# EAGLE design receiver (EAGLE 7.4.0)
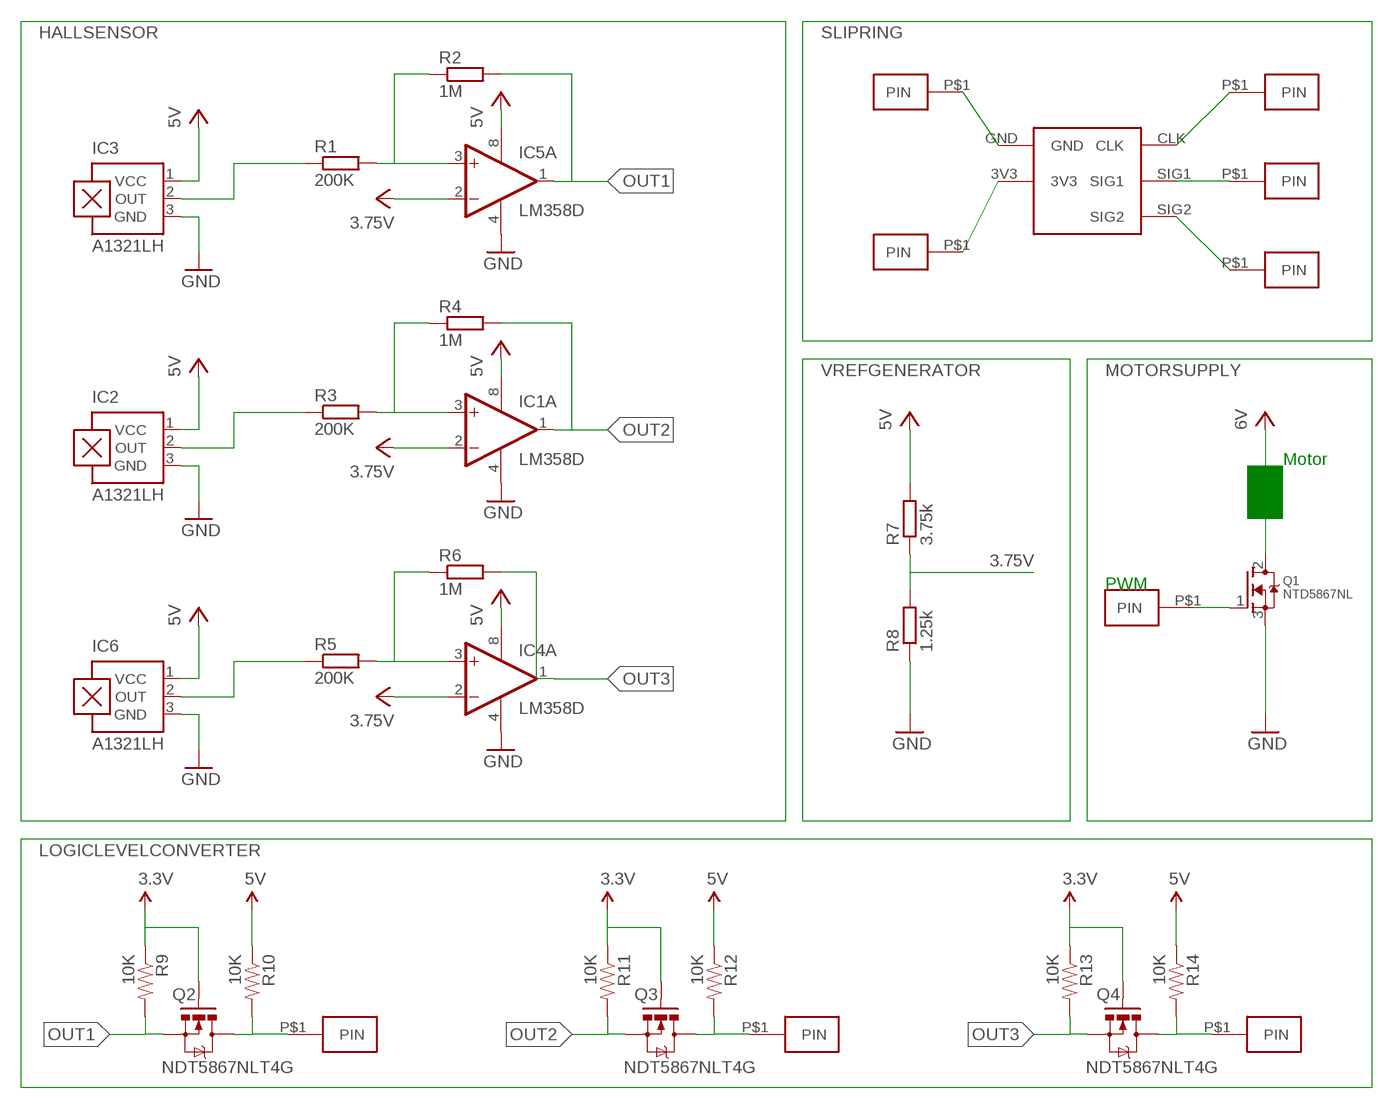
[diagram p0: schematic, sheet 1]

## Parts
IC1  LM358D  [SO08]
IC2  A1321LH  [SOT23-W]
IC3  A1321LH  [SOT23-W]
IC4  LM358D  [SO08]
IC5  LM358D  [SO08]
IC6  A1321LH  [SOT23-W]
PWM  PWM  CONNECTOR  [CONNECTOR]
Q1  NTD5867NL  MOSFET-NGDS_TO220V  [TO220V]
Q2  NDT5867NLT4G  MOSFET-NCHANNELSMD  [SOT23-3]
Q3  NDT5867NLT4G  MOSFET-NCHANNELSMD  [SOT23-3]
Q4  NDT5867NLT4G  MOSFET-NCHANNELSMD  [SOT23-3]
R1  200K  R-EU_R0805  [R0805]
R2  1M  R-EU_R0805  [R0805]
R3  200K  R-EU_R0805  [R0805]
R4  1M  R-EU_R0805  [R0805]
R5  200K  R-EU_R0805  [R0805]
R6  1M  R-EU_R0805  [R0805]
R7  3.75k  R-EU_R0805  [R0805]
R8  1.25k  R-EU_R0805  [R0805]
R9  10K  RESISTOR0603-RES  [0603-RES]
R10  10K  RESISTOR0603-RES  [0603-RES]
R11  10K  RESISTOR0603-RES  [0603-RES]
R12  10K  RESISTOR0603-RES  [0603-RES]
R13  10K  RESISTOR0603-RES  [0603-RES]
R14  10K  RESISTOR0603-RES  [0603-RES]
U$1  SLIP-RING  [SLIP-RING]
U$2  CONNECTOR  [CONNECTOR]
U$3  CONNECTOR  [CONNECTOR]
U$4  CONNECTOR  [CONNECTOR]
U$5  CONNECTOR  [CONNECTOR]
U$6  CONNECTOR  [CONNECTOR]
U$7  CONNECTOR  [CONNECTOR]
U$8  CONNECTOR  [CONNECTOR]
U$9  CONNECTOR  [CONNECTOR]

## Nets
1: IC5.1(A:OUT) R2.2
2: IC1.1(A:OUT) R4.2
3: IC4.1(A:OUT) R6.2
3.75V: IC5.2(A:-IN) R7.1 R8.2
5V: IC1.8(P:V+) IC2.1(VCC) IC3.1(VCC) IC4.8(P:V+) IC5.8(P:V+) IC6.1(VCC) R7.2
GND: IC1.4(P:V-) IC2.3(GND) IC3.3(GND) IC4.4(P:V-) IC5.4(P:V-) IC6.3(GND) Q1.3(S) R8.1
HV: R10.1 R12.1 R14.1 ; supply symbol labelled 5V
HV1: Q2.3(D) R10.2 U$4.P$1(PIN)
HV2: Q3.3(D) R12.2 U$2.P$1(PIN)
HV3: Q4.3(D) R14.2 U$3.P$1(PIN)
N$1: IC2.2(OUT) R3.1
N$2: PWM.P$1(PIN)
N$4: IC3.2(OUT) R1.1
N$5: IC5.3(A:+IN) R1.2 R2.1
N$7: IC6.2(OUT) R5.1
N$8: IC4.3(A:+IN) R5.2 R6.1
N$10: U$1.CLK U$5.P$1(PIN)
N$11: U$1.SIG1 U$6.P$1(PIN)
N$12: U$1.SIG2 U$7.P$1(PIN)
N$13: U$1.GND U$8.P$1(PIN)
N$14: U$1.3V3 U$9.P$1(PIN)
OUT1: Q2.2(S) R9.2
OUT2: Q3.2(S) R11.2
OUT3: Q4.2(S) R13.2
R20: IC1.3(A:+IN) R3.2 R4.1
VCC: IC1.2(A:-IN) IC4.2(A:-IN) Q1.2(D) Q2.1(G) Q3.1(G) Q4.1(G) R9.1 R11.1 R13.1 ; supply symbol labelled 3.75V, 6V, 3.3V
Unconnected: IC1.5(B:+IN) IC1.6(B:-IN) IC1.7(B:OUT) IC4.5(B:+IN) IC4.6(B:-IN) IC4.7(B:OUT) IC5.5(B:+IN) IC5.6(B:-IN) IC5.7(B:OUT) Q1.1(G)

## Notes on the sheet
- Motor
- PWM

## Library data of the parts
IC1 IC4 IC5 = linear:LM358: OP AMP also LM158; LM258; LM2904 Source: http://cache.national.com/ds/LM/LM158.pdf
IC2 IC3 IC6 = allegro:A13*?: Linear Hall Effect Sensor ICs Continuous-Time Ratiometric High-Temperature Operation Programmable Linear with Analog Output A1302 -Replacement- UGN3503 Source: http://www.allegromicro.com/en/Products/Part_Numbers/1301/1301.pdf http://www.allegromicro.com/en/Products/Part_Numbers/1321/1321.pdf http://www.allegromicro.com/en/Products/Part_Numbers/1381/1381.pdf; MF: ALLEGRO MICROSYSTEMS, INC.; MPN: A1321LLHLT-T; OC_FARNELL: 1457116; OC_NEWARK: 65K5146
PWM U$2-U$9 = slip_ring:CONNECTOR
Q1 = adafruit:MOSFET-N: N-Channel Mosfet 2N7002E - 60V 260mA SOT23 [Digikey: 2N7002ET1GOSTR-ND] - REEL BSH103 - 30V 850mA SOT23 [Digikey: 568-5013-1-ND]
Q2-Q4 = SparkFun:MOSFET-NCHANNEL
R1-R8 = resistor:R-EU_: RESISTOR, European symbol
R9-R14 = SparkFun:RESISTOR: Resistor Basic schematic elements and footprints for 0603, 1206, and PTH resistors.
U$1 = slip_ring:SLIP-RING: Slip ring. Stationary part of a slip ring.

## Board
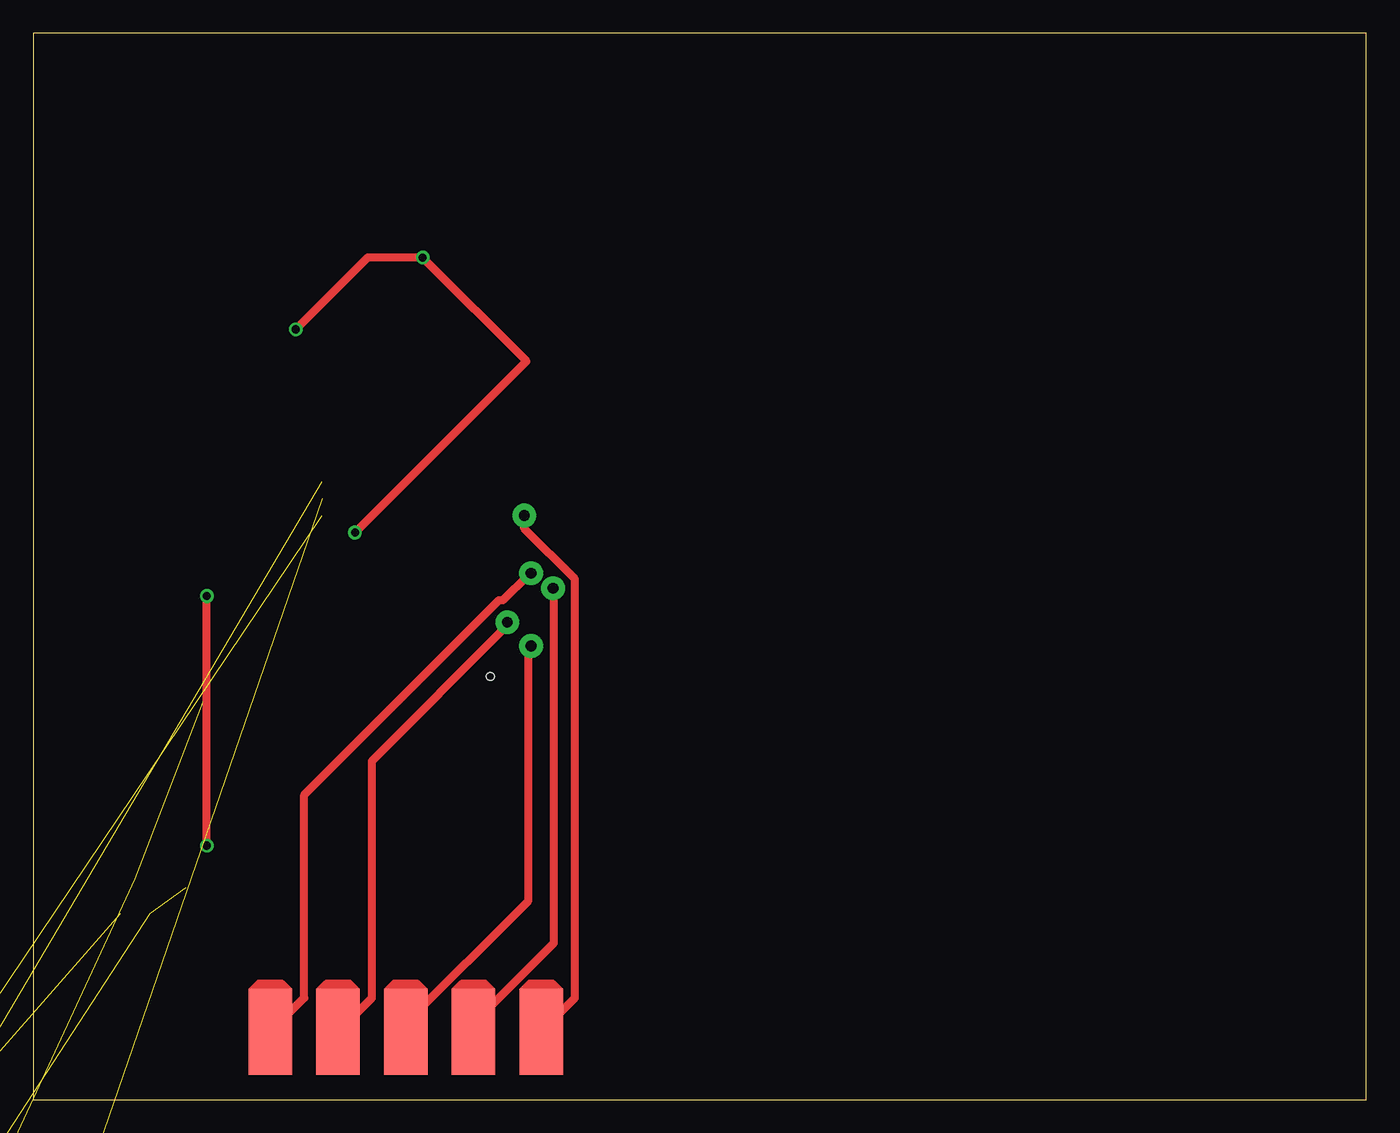
[diagram p1: board, top side]
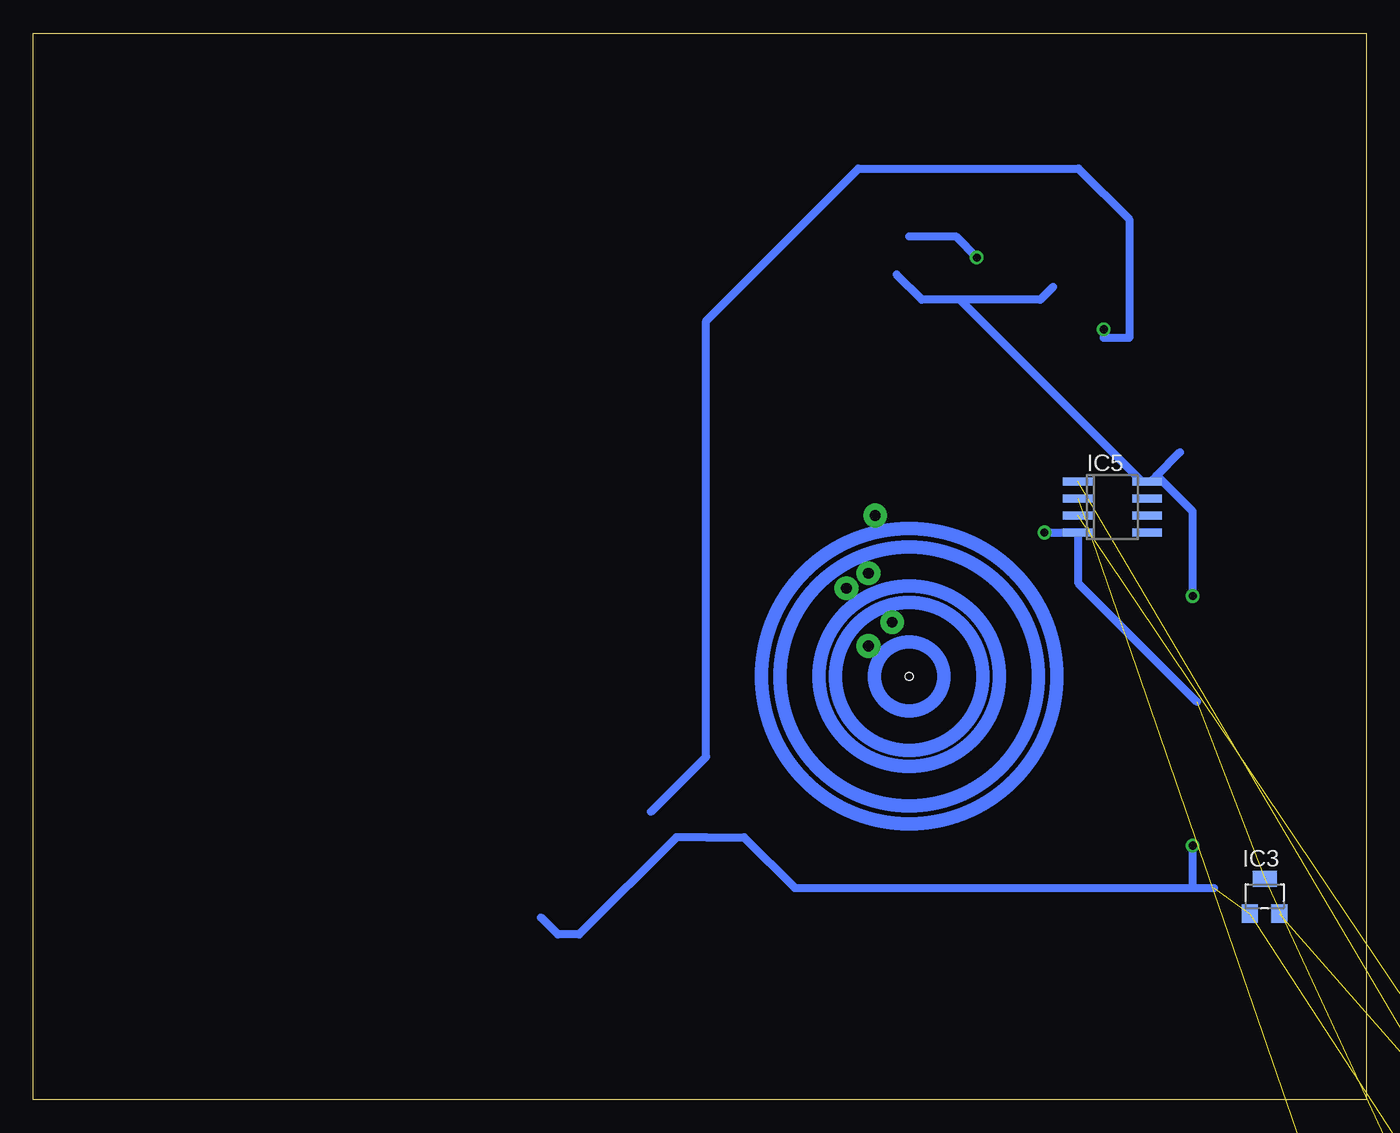
[diagram p2: board, bottom side, seen from below]

Size 100 x 80 mm. Coordinates in mm from the lower left corner, seen from the top.
Outline: 0,0 100,0 100,80 0,80 0,0
Copper layers (1*16): Top 0.035mm / dielectric 1.5mm / Bottom 0.035mm
Design rules "default *": minimum track width 24mil, minimum drill 24mil, track to track 12mil, track to pad 12mil, pad to pad 12mil, via to via 12mil, smd to smd 12mil, copper to edge 40mil, drill to drill 8mil, minimum pad ring 10mil, minimum via ring 8mil, stop-mask expansion 4mil, vias tented up to drill 0mil, thermal gap 10mil

### Footprints (pad centres in the part's own frame; a part is rotated, then mirrored left to right if it is on the bottom)
SO08 = smd 0.6 x 2.2: 1 -1.905,-2.6; 2 -0.635,-2.6; 3 0.635,-2.6; 4 1.905,-2.6; 5 1.905,2.6; 6 0.635,2.6; 7 -0.635,2.6; 8 -1.905,2.6
SOT23-W = smd 1.2 x 1.4: 1 -1.1,-1.3; 2 1.1,-1.3 | smd 1.8 x 1.2: 3 0,1.3
CONNECTOR = smd 3.251 x 6.452: P$1 0,0
TO220V = drill 1.016 long: 1 -2.54,-2.54; 2 0,-2.54; 3 2.54,-2.54
SOT23-3 = smd 0.8 x 0.9: 1 -0.95,-1; 2 0.95,-1; 3 0,1.1
R0805 = smd 1.3 x 1.5: 1 -0.85,0; 2 0.85,0
0603-RES = smd 1.1 x 1: 1 -0.85,0; 2 0.85,0
SLIP-RING = drill 0.8 pad 1.778: 3V3 3.048,2.286; CLK 4.699,6.604; GND 1.27,4.064; SIG1 3.048,7.747; SIG2 2.54,12.065 | hole 0.6: 0,0

### Placement (x,y rotation side)
IC1  -19.05,-34.29 0 top  (outside the outline)
IC2  -20.32,-43.18 0 top  (outside the outline)
IC3  7.62,15.24 0 bottom
IC4  -19.05,-59.69 0 top  (outside the outline)
IC5  19.05,44.45 270 bottom
IC6  -20.32,-68.58 0 top  (outside the outline)
PWM  -30.48,-96.52 0 top  (outside the outline)
Q1  -17.78,-92.71 0 top  (outside the outline)
Q2  -30.48,-104.14 0 top  (outside the outline)
Q3  -26.67,-113.03 0 top  (outside the outline)
Q4  -26.67,-124.46 0 top  (outside the outline)
R1  -21.59,-19.05 0 top  (outside the outline)
R2  -21.59,-25.4 0 top  (outside the outline)
R3  -21.59,-50.8 0 top  (outside the outline)
R4  -15.24,-50.8 0 top  (outside the outline)
R5  -21.59,-76.2 0 top  (outside the outline)
R6  -15.24,-76.2 0 top  (outside the outline)
R7  -21.59,-82.55 0 top  (outside the outline)
R8  -21.59,-88.9 0 top  (outside the outline)
R9  -26.67,-102.87 0 top  (outside the outline)
R10  -30.48,-107.95 0 top  (outside the outline)
R11  -30.48,-119.38 0 top  (outside the outline)
R12  -26.67,-119.38 0 top  (outside the outline)
R13  -30.48,-130.81 0 top  (outside the outline)
R14  -26.67,-130.81 0 top  (outside the outline)
U$1  34.29,31.75 0 top
U$2  -30.48,-114.3 0 top  (outside the outline)
U$3  -30.48,-125.73 0 top  (outside the outline)
U$4  -12.7,-68.58 0 top  (outside the outline)
U$5  33.02,5.08 0 top
U$6  17.78,5.08 0 top
U$7  38.1,5.08 0 top
U$8  22.86,5.08 0 top
U$9  27.94,5.08 0 top

### Tracks (layer width: path | path; a pad name or v marks a point on that pad's centre or on a via)
1  (1 unrouted)
2  (1 unrouted)
3  (1 unrouted)
3.75V  (2 unrouted)
5V  (via drill 0.61)  (6 unrouted)
  Top 0.61: v13.02,19.05 v13.02,37.78
  Bottom 0.61: 15.72,46.83 16.19,46.35 IC5.8 16.83,46.35 30.48,60.01 | 15.72,46.83 13.97,48.58 | 35.24,61.91 33.34,60.01 30.48,60.01 | 30.48,60.01 24.45,60.01 23.5,60.96 | 61.91,13.65 60.64,12.38 59.05,12.38 51.75,19.68 49.53,19.68 46.67,19.68 42.86,15.88 13.02,15.88 | 13.02,15.88 11.43,15.88 | 15.72,46.83 13.02,44.13 v13.02,37.78 | 13.02,15.88 v13.02,19.05
GND  (via drill 0.61)  (7 unrouted)
  Top 0.61: v19.68,57.78 25.08,63.18 v29.21,63.18 36.99,55.4 v24.13,42.55
  Bottom 0.61: 12.7,29.84 21.59,38.73 21.59,42.55 IC5.4 v24.13,42.55 | 34.29,64.77 30.8,64.77 v29.21,63.18 | v19.68,57.78 19.68,57.15 17.78,57.15 17.78,66.04 21.59,69.85 38.1,69.85 49.53,58.42 49.53,25.72 53.66,21.59
HV  (2 unrouted)
HV1  (2 unrouted)
HV2  (2 unrouted)
HV3  (2 unrouted)
N$1  (1 unrouted)
N$4  (1 unrouted)
N$5  (2 unrouted)
N$7  (1 unrouted)
N$8  (2 unrouted)
N$10
  Top 0.61: U$5.P$1 33.02,5.71 39.05,11.75 39.05,38.1 U$1.CLK
N$11
  Top 0.61: U$6.P$1 20.32,7.62 20.32,22.86 34.92,37.47 35.24,37.47 37.15,39.37 U$1.SIG1
N$12
  Top 0.61: U$1.SIG2 36.83,42.86 40.64,39.05 40.64,7.62 U$7.P$1
N$13
  Top 0.61: U$8.P$1 25.4,7.62 25.4,25.4 35.56,35.56 U$1.GND
N$14
  Top 0.61: U$9.P$1 27.94,5.71 37.15,14.92 37.15,33.97 U$1.3V3
OUT1  (1 unrouted)
OUT2  (1 unrouted)
OUT3  (1 unrouted)
R20  (2 unrouted)
VCC  (8 unrouted)